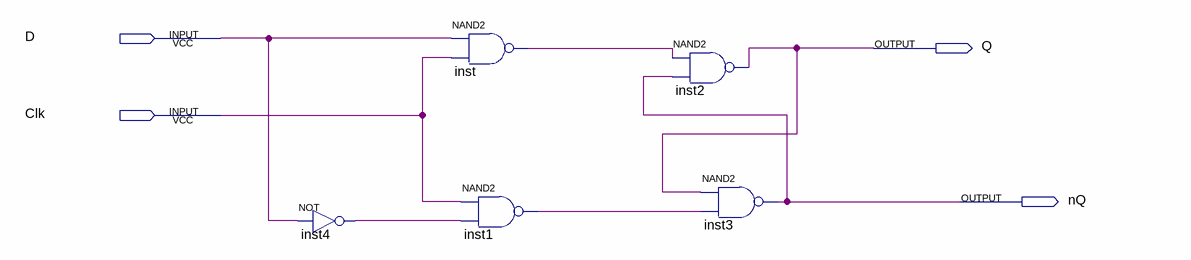
[diagram p0: schematic sheet]
// Quartus schematic part4.bdf as structural Verilog: 5 symbols, 4 pins
module part4 (
  input  D,
  input  Clk,
  output Q,
  output nQ
);

  wire inst1_out, inst4_out, inst_out;

  not inst4 (inst4_out, D);
  nand inst (inst_out, D, Clk);
  nand inst1 (inst1_out, Clk, inst4_out);
  nand inst2 (Q, inst_out, nQ);
  nand inst3 (nQ, Q, inst1_out);
endmodule
